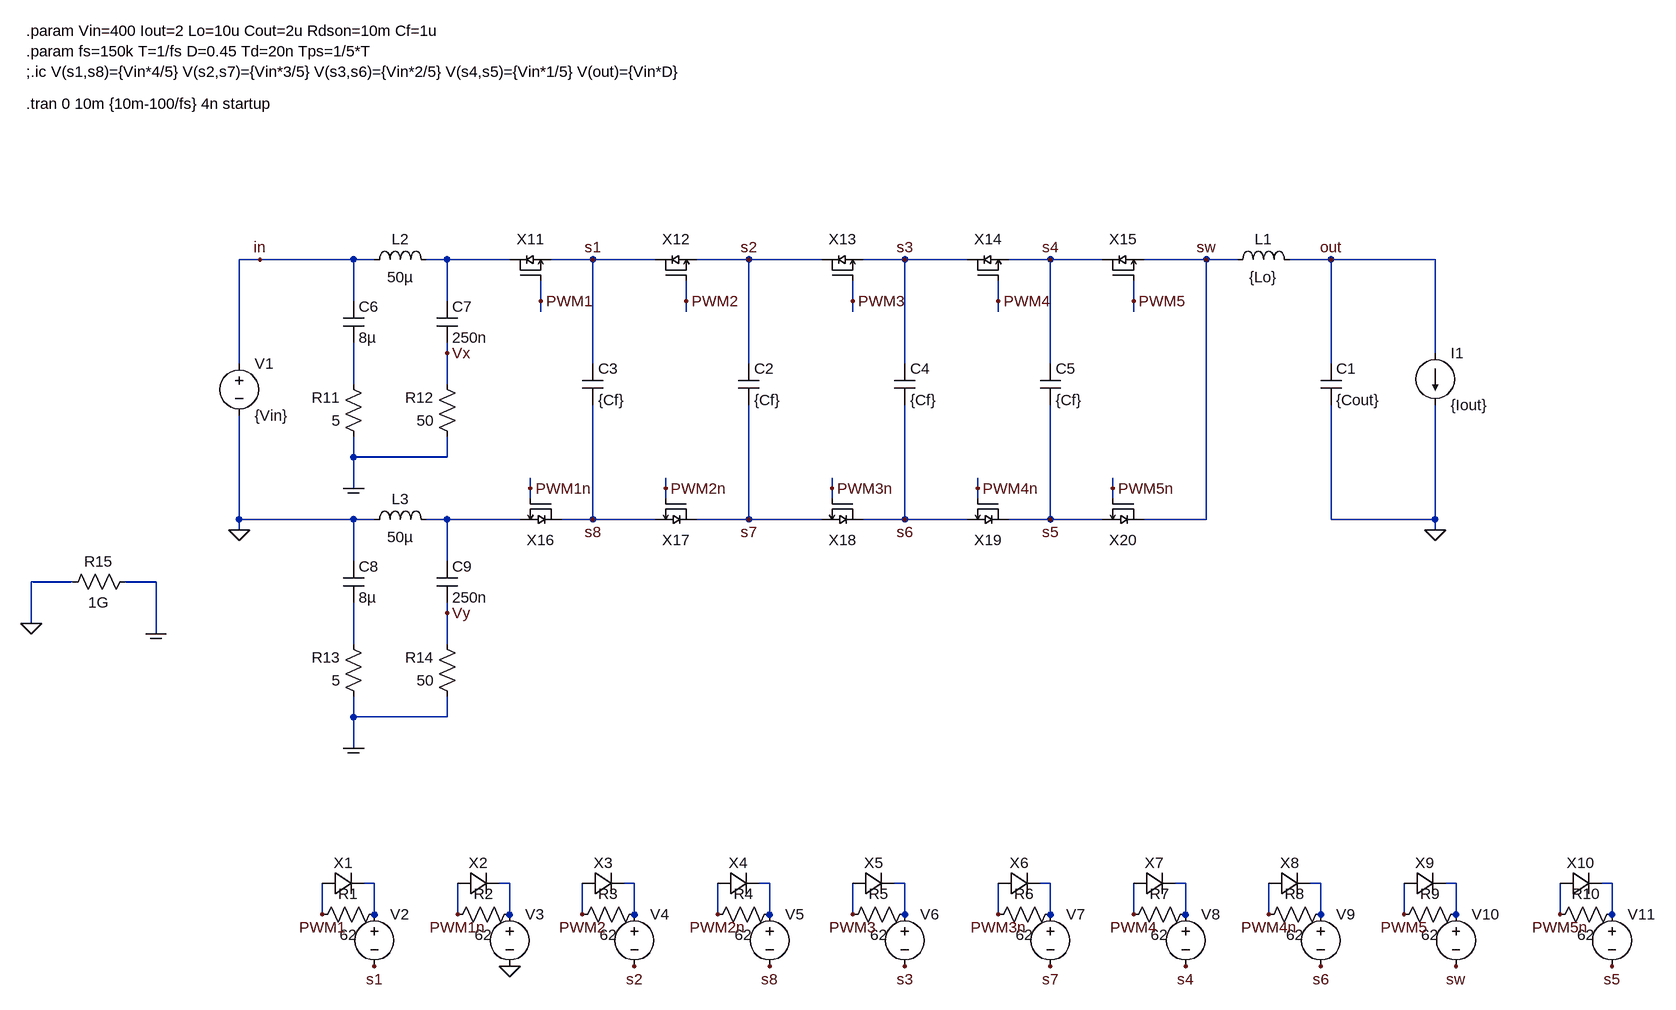
[diagram p0: schematic FCML_5Level_GaNSys_D045_2A.asc]
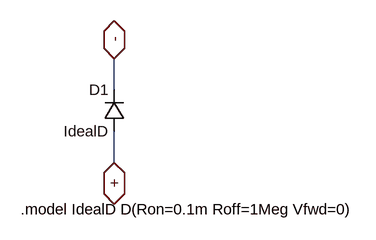
[diagram p1: sub-circuit idealdiode.asc]
FCML_5Level_GaNSys_D045_2A.asc, the LTspice schematic file:
Version 4
SHEET 1 1656 988
WIRE -496 -176 -528 -176
WIRE -352 -176 -496 -176
WIRE -320 -176 -352 -176
WIRE -208 -176 -240 -176
WIRE -112 -176 -208 -176
WIRE 16 -176 -48 -176
WIRE 112 -176 16 -176
WIRE 256 -176 176 -176
WIRE 368 -176 256 -176
WIRE 496 -176 432 -176
WIRE 592 -176 496 -176
WIRE 720 -176 656 -176
WIRE 800 -176 720 -176
WIRE 960 -176 864 -176
WIRE 1008 -176 960 -176
WIRE 1152 -176 1088 -176
WIRE 1312 -176 1152 -176
WIRE -352 -112 -352 -176
WIRE -208 -112 -208 -176
WIRE -64 -112 -64 -144
WIRE 160 -112 160 -144
WIRE 416 -112 416 -144
WIRE 640 -112 640 -144
WIRE 848 -112 848 -144
WIRE -64 -96 -64 -112
WIRE 160 -96 160 -112
WIRE 416 -96 416 -112
WIRE 640 -96 640 -112
WIRE 848 -96 848 -112
WIRE -208 -32 -208 -48
WIRE 1312 -32 1312 -176
WIRE -528 -16 -528 -176
WIRE 16 -16 16 -176
WIRE 256 -16 256 -176
WIRE 496 -16 496 -176
WIRE 720 -16 720 -176
WIRE 1152 -16 1152 -176
WIRE -352 16 -352 -48
WIRE -208 16 -208 -32
WIRE -352 128 -352 96
WIRE -208 128 -208 96
WIRE -208 128 -352 128
WIRE -352 176 -352 128
WIRE -80 176 -80 160
WIRE 128 176 128 160
WIRE 384 176 384 160
WIRE 608 176 608 160
WIRE 816 176 816 160
WIRE -80 192 -80 176
WIRE 128 192 128 176
WIRE 384 192 384 176
WIRE 608 192 608 176
WIRE 816 192 816 176
WIRE -528 224 -528 64
WIRE -352 224 -528 224
WIRE -320 224 -352 224
WIRE -208 224 -240 224
WIRE -96 224 -208 224
WIRE 16 224 16 48
WIRE 16 224 -32 224
WIRE 112 224 16 224
WIRE 256 224 256 48
WIRE 256 224 176 224
WIRE 368 224 256 224
WIRE 496 224 496 48
WIRE 496 224 432 224
WIRE 592 224 496 224
WIRE 720 224 720 48
WIRE 720 224 656 224
WIRE 800 224 720 224
WIRE 960 224 960 -176
WIRE 960 224 864 224
WIRE 1152 224 1152 48
WIRE 1312 224 1312 48
WIRE 1312 224 1152 224
WIRE -528 240 -528 224
WIRE 1312 240 1312 224
WIRE -352 288 -352 224
WIRE -208 288 -208 224
WIRE -784 320 -848 320
WIRE -656 320 -704 320
WIRE -208 368 -208 352
WIRE -848 384 -848 320
WIRE -656 400 -656 320
WIRE -352 416 -352 352
WIRE -208 416 -208 368
WIRE -352 528 -352 496
WIRE -208 528 -208 496
WIRE -208 528 -352 528
WIRE -352 576 -352 528
WIRE -320 784 -336 784
WIRE -112 784 -128 784
WIRE 80 784 64 784
WIRE 288 784 272 784
WIRE 496 784 480 784
WIRE 720 784 704 784
WIRE 928 784 912 784
WIRE 1136 784 1120 784
WIRE 1344 784 1328 784
WIRE 1584 784 1568 784
WIRE -400 832 -400 784
WIRE -320 832 -320 784
WIRE -192 832 -192 784
WIRE -112 832 -112 784
WIRE 0 832 0 784
WIRE 80 832 80 784
WIRE 208 832 208 784
WIRE 288 832 288 784
WIRE 416 832 416 784
WIRE 496 832 496 784
WIRE 640 832 640 784
WIRE 720 832 720 784
WIRE 848 832 848 784
WIRE 928 832 928 784
WIRE 1056 832 1056 784
WIRE 1136 832 1136 784
WIRE 1264 832 1264 784
WIRE 1344 832 1344 784
WIRE 1504 832 1504 784
WIRE 1584 832 1584 784
FLAG -528 240 0
FLAG 1312 240 0
FLAG -400 832 PWM1
FLAG -192 832 PWM1n
FLAG 0 832 PWM2
FLAG 208 832 PWM2n
FLAG -496 -176 in
FLAG 960 -176 sw
FLAG 1152 -176 out
FLAG 128 176 PWM2n
FLAG 416 -112 PWM3
FLAG 384 176 PWM3n
FLAG -64 -112 PWM1
FLAG -80 176 PWM1n
FLAG 416 832 PWM3
FLAG 640 832 PWM3n
FLAG 640 -112 PWM4
FLAG 608 176 PWM4n
FLAG 848 832 PWM4
FLAG 1056 832 PWM4n
FLAG 160 -112 PWM2
FLAG 848 -112 PWM5
FLAG 816 176 PWM5n
FLAG 1264 832 PWM5
FLAG 1504 832 PWM5n
FLAG 16 -176 s1
FLAG 256 -176 s2
FLAG 496 -176 s3
FLAG 720 -176 s4
FLAG 720 224 s5
FLAG 496 224 s6
FLAG 256 224 s7
FLAG 16 224 s8
FLAG -320 912 s1
FLAG -112 912 0
FLAG 80 912 s2
FLAG 288 912 s8
FLAG 496 912 s3
FLAG 720 912 s7
FLAG 1136 912 s6
FLAG 1584 912 s5
FLAG 928 912 s4
FLAG 1344 912 sw
FLAG -352 176 COM
FLAG -208 -32 Vx
FLAG -352 576 COM
FLAG -208 368 Vy
FLAG -848 384 0
FLAG -656 400 COM
SYMBOL voltage -528 -32 R0
WINDOW 123 0 0 Left 0
WINDOW 39 0 0 Left 0
SYMATTR InstName V1
SYMATTR Value {Vin}
SYMBOL ind 992 -160 R270
WINDOW 0 32 56 VTop 2
WINDOW 3 5 56 VBottom 2
SYMATTR InstName L1
SYMATTR Value {Lo}
SYMATTR SpiceLine Rser=9.33m
SYMBOL cap 1136 -16 R0
SYMATTR InstName C1
SYMATTR Value {Cout}
SYMATTR SpiceLine Rser=1m
SYMBOL cap 240 -16 R0
SYMATTR InstName C2
SYMATTR Value {Cf}
SYMATTR SpiceLine Rser=4.3m Lser=.65n
SYMBOL voltage -320 816 R0
WINDOW 3 24 96 Invisible 2
WINDOW 123 0 0 Left 0
WINDOW 39 0 0 Left 0
SYMATTR Value PULSE(0 5 0 1n 1n {D*T} {T})
SYMATTR InstName V2
SYMBOL voltage -112 816 R0
WINDOW 3 24 96 Invisible 2
SYMATTR Value PULSE(0 5 {D*T+Td} 1n 1n {T-D*T-2*Td} {T})
SYMATTR InstName V3
SYMBOL voltage 80 816 R0
WINDOW 3 24 96 Invisible 2
WINDOW 123 0 0 Left 0
WINDOW 39 0 0 Left 0
SYMATTR Value PULSE(0 5 {Tps} 1n 1n {D*T} {T})
SYMATTR InstName V4
SYMBOL voltage 288 816 R0
WINDOW 3 24 96 Invisible 2
WINDOW 123 0 0 Left 0
WINDOW 39 0 0 Left 0
SYMATTR Value PULSE(0 5 {Tps+D*T+Td} 1n 1n {T-D*T-2*Td} {T})
SYMATTR InstName V5
SYMBOL cap 0 -16 R0
SYMATTR InstName C3
SYMATTR Value {Cf}
SYMATTR SpiceLine Rser=4.3m Lser=.65n
SYMBOL voltage 496 816 R0
WINDOW 3 24 96 Invisible 2
WINDOW 123 0 0 Left 0
WINDOW 39 0 0 Left 0
SYMATTR Value PULSE(0 5 {Tps*2} 1n 1n {D*T} {T})
SYMATTR InstName V6
SYMBOL voltage 720 816 R0
WINDOW 3 24 96 Invisible 2
WINDOW 123 0 0 Left 0
WINDOW 39 0 0 Left 0
SYMATTR Value PULSE(0 5 {Tps*2+D*T+Td} 1n 1n {T-D*T-2*Td} {T})
SYMATTR InstName V7
SYMBOL cap 480 -16 R0
SYMATTR InstName C4
SYMATTR Value {Cf}
SYMATTR SpiceLine Rser=4.3m Lser=.65n
SYMBOL voltage 928 816 R0
WINDOW 3 24 96 Invisible 2
WINDOW 123 0 0 Left 0
WINDOW 39 0 0 Left 0
SYMATTR Value PULSE(0 5 {Tps*3} 1n 1n {D*T} {T})
SYMATTR InstName V8
SYMBOL voltage 1136 816 R0
WINDOW 3 24 96 Invisible 2
WINDOW 123 0 0 Left 0
WINDOW 39 0 0 Left 0
SYMATTR Value PULSE(0 5 {Tps*3+D*T+Td} 1n 1n {T-D*T-2*Td} {T})
SYMATTR InstName V9
SYMBOL cap 704 -16 R0
SYMATTR InstName C5
SYMATTR Value {Cf}
SYMATTR SpiceLine Rser=4.3m Lser=.65n
SYMBOL voltage 1344 816 R0
WINDOW 3 24 96 Invisible 2
WINDOW 123 0 0 Left 0
WINDOW 39 0 0 Left 0
SYMATTR Value PULSE(0 5 {Tps*4} 1n 1n {D*T} {T})
SYMATTR InstName V10
SYMBOL voltage 1584 816 R0
WINDOW 3 24 96 Invisible 2
WINDOW 123 0 0 Left 0
WINDOW 39 0 0 Left 0
SYMATTR Value PULSE(0 5 {Tps*4+D*T+Td} 1n 1n {T-D*T-2*Td} {T})
SYMATTR InstName V11
SYMBOL res -304 816 R90
WINDOW 0 0 56 VBottom 2
WINDOW 3 32 56 VTop 2
SYMATTR InstName R1
SYMATTR Value 62
SYMBOL res -96 816 R90
WINDOW 0 0 56 VBottom 2
WINDOW 3 32 56 VTop 2
SYMATTR InstName R2
SYMATTR Value 62
SYMBOL res 96 816 R90
WINDOW 0 0 56 VBottom 2
WINDOW 3 32 56 VTop 2
SYMATTR InstName R3
SYMATTR Value 62
SYMBOL res 304 816 R90
WINDOW 0 0 56 VBottom 2
WINDOW 3 32 56 VTop 2
SYMATTR InstName R4
SYMATTR Value 62
SYMBOL res 512 816 R90
WINDOW 0 0 56 VBottom 2
WINDOW 3 32 56 VTop 2
SYMATTR InstName R5
SYMATTR Value 62
SYMBOL res 736 816 R90
WINDOW 0 0 56 VBottom 2
WINDOW 3 32 56 VTop 2
SYMATTR InstName R6
SYMATTR Value 62
SYMBOL res 944 816 R90
WINDOW 0 0 56 VBottom 2
WINDOW 3 32 56 VTop 2
SYMATTR InstName R7
SYMATTR Value 62
SYMBOL res 1152 816 R90
WINDOW 0 0 56 VBottom 2
WINDOW 3 32 56 VTop 2
SYMATTR InstName R8
SYMATTR Value 62
SYMBOL res 1360 816 R90
WINDOW 0 0 56 VBottom 2
WINDOW 3 32 56 VTop 2
SYMATTR InstName R9
SYMATTR Value 62
SYMBOL res 1600 816 R90
WINDOW 0 0 56 VBottom 2
WINDOW 3 32 56 VTop 2
SYMATTR InstName R10
SYMATTR Value 62
SYMBOL IdealDiode -400 800 R270
WINDOW 0 32 32 VTop 2
SYMATTR InstName X1
SYMBOL IdealDiode -192 800 R270
WINDOW 0 32 32 VTop 2
SYMATTR InstName X2
SYMBOL IdealDiode 0 800 R270
WINDOW 0 32 32 VTop 2
SYMATTR InstName X3
SYMBOL IdealDiode 208 800 R270
WINDOW 0 32 32 VTop 2
SYMATTR InstName X4
SYMBOL IdealDiode 416 800 R270
WINDOW 0 32 32 VTop 2
SYMATTR InstName X5
SYMBOL IdealDiode 640 800 R270
WINDOW 0 32 32 VTop 2
SYMATTR InstName X6
SYMBOL IdealDiode 848 800 R270
WINDOW 0 32 32 VTop 2
SYMATTR InstName X7
SYMBOL IdealDiode 1056 800 R270
WINDOW 0 32 32 VTop 2
SYMATTR InstName X8
SYMBOL IdealDiode 1264 800 R270
WINDOW 0 32 32 VTop 2
SYMATTR InstName X9
SYMBOL IdealDiode 1504 800 R270
WINDOW 0 32 32 VTop 2
SYMATTR InstName X10
SYMBOL current 1312 -32 R0
WINDOW 123 0 0 Left 0
WINDOW 39 0 0 Left 0
SYMATTR InstName I1
SYMATTR Value {Iout}
SYMBOL IdealSW -80 -160 R0
SYMATTR InstName X11
SYMBOL IdealSW 144 -160 R0
SYMATTR InstName X12
SYMBOL IdealSW 400 -160 R0
SYMATTR InstName X13
SYMBOL IdealSW 624 -160 R0
SYMATTR InstName X14
SYMBOL IdealSW 832 -160 R0
SYMATTR InstName X15
SYMBOL IdealSW -64 208 R180
SYMATTR InstName X16
SYMBOL IdealSW 144 208 R180
SYMATTR InstName X17
SYMBOL IdealSW 400 208 R180
SYMATTR InstName X18
SYMBOL IdealSW 624 208 R180
SYMATTR InstName X19
SYMBOL IdealSW 832 208 R180
SYMATTR InstName X20
SYMBOL res -336 112 R180
WINDOW 0 36 76 Left 2
WINDOW 3 36 40 Left 2
SYMATTR InstName R11
SYMATTR Value 5
SYMBOL res -192 112 R180
WINDOW 0 36 76 Left 2
WINDOW 3 36 40 Left 2
SYMATTR InstName R12
SYMATTR Value 50
SYMBOL ind -336 -160 R270
WINDOW 0 32 56 VTop 2
WINDOW 3 5 56 VBottom 2
SYMATTR InstName L2
SYMATTR Value 50µ
SYMBOL cap -368 -112 R0
SYMATTR InstName C6
SYMATTR Value 8µ
SYMBOL cap -224 -112 R0
SYMATTR InstName C7
SYMATTR Value 250n
SYMBOL res -336 512 R180
WINDOW 0 36 76 Left 2
WINDOW 3 36 40 Left 2
SYMATTR InstName R13
SYMATTR Value 5
SYMBOL res -192 512 R180
WINDOW 0 36 76 Left 2
WINDOW 3 36 40 Left 2
SYMATTR InstName R14
SYMATTR Value 50
SYMBOL ind -336 240 R270
WINDOW 0 32 56 VTop 2
WINDOW 3 5 56 VBottom 2
SYMATTR InstName L3
SYMATTR Value 50µ
SYMBOL cap -368 288 R0
SYMATTR InstName C8
SYMATTR Value 8µ
SYMBOL cap -224 288 R0
SYMATTR InstName C9
SYMATTR Value 250n
SYMBOL res -800 336 R270
WINDOW 0 32 56 VTop 2
WINDOW 3 0 56 VBottom 2
SYMATTR InstName R15
SYMATTR Value 1G
TEXT -856 -528 Left 2 !.param Vin=400 Iout=2 Lo=10u Cout=2u Rdson=10m Cf=1u\n.param fs=150k T=1/fs D=0.45 Td=20n Tps=1/5*T\n;.ic V(s1,s8)={Vin*4/5} V(s2,s7)={Vin*3/5} V(s3,s6)={Vin*2/5} V(s4,s5)={Vin*1/5} V(out)={Vin*D}
TEXT -856 -416 Left 2 !.tran 0 10m {10m-100/fs} 4n startup

idealdiode.asc, the sub-circuit schematic file:
Version 4
SHEET 1 880 680
WIRE 336 144 336 96
WIRE 336 256 336 208
FLAG 336 96 -
IOPIN 336 96 BiDir
FLAG 336 256 +
IOPIN 336 256 BiDir
SYMBOL diode 352 208 R180
WINDOW 0 24 64 Left 2
WINDOW 3 24 0 Left 2
SYMATTR InstName D1
SYMATTR Value IdealD
TEXT 192 328 Left 2 !.model IdealD D(Ron=0.1m Roff=1Meg Vfwd=0)

The netlist it stands for:
* FCML_5Level_GaNSys_D045_2A.asc
V1 in 0 {Vin}
L1 sw out {Lo} Rser=9.33m
C1 out 0 {Cout} Rser=1m
C2 s2 s7 {Cf} Rser=4.3m Lser=.65n
V2 N005 s1 PULSE(0 5 0 1n 1n {D*T} {T})
V3 N006 0 PULSE(0 5 {D*T+Td} 1n 1n {T-D*T-2*Td} {T})
V4 N007 s2 PULSE(0 5 {Tps} 1n 1n {D*T} {T})
V5 N008 s8 PULSE(0 5 {Tps+D*T+Td} 1n 1n {T-D*T-2*Td} {T})
C3 s1 s8 {Cf} Rser=4.3m Lser=.65n
V6 N009 s3 PULSE(0 5 {Tps*2} 1n 1n {D*T} {T})
V7 N010 s7 PULSE(0 5 {Tps*2+D*T+Td} 1n 1n {T-D*T-2*Td} {T})
C4 s3 s6 {Cf} Rser=4.3m Lser=.65n
V8 N011 s4 PULSE(0 5 {Tps*3} 1n 1n {D*T} {T})
V9 N012 s6 PULSE(0 5 {Tps*3+D*T+Td} 1n 1n {T-D*T-2*Td} {T})
C5 s4 s5 {Cf} Rser=4.3m Lser=.65n
V10 N013 sw PULSE(0 5 {Tps*4} 1n 1n {D*T} {T})
V11 N014 s5 PULSE(0 5 {Tps*4+D*T+Td} 1n 1n {T-D*T-2*Td} {T})
R1 N005 PWM1 62
R2 N006 PWM1n 62
R3 N007 PWM2 62
R4 N008 PWM2n 62
R5 N009 PWM3 62
R6 N010 PWM3n 62
R7 N011 PWM4 62
R8 N012 PWM4n 62
R9 N013 PWM5 62
R10 N014 PWM5n 62
XX1 PWM1 N005 idealdiode
XX2 PWM1n N006 idealdiode
XX3 PWM2 N007 idealdiode
XX4 PWM2n N008 idealdiode
XX5 PWM3 N009 idealdiode
XX6 PWM3n N010 idealdiode
XX7 PWM4 N011 idealdiode
XX8 PWM4n N012 idealdiode
XX9 PWM5 N013 idealdiode
XX10 PWM5n N014 idealdiode
I1 out 0 {Iout}
XX11 N001 PWM1 s1 IdealSW  ; pins D G S
XX12 s1 PWM2 s2 IdealSW  ; pins D G S
XX13 s2 PWM3 s3 IdealSW  ; pins D G S
XX14 s3 PWM4 s4 IdealSW  ; pins D G S
XX15 s4 PWM5 sw IdealSW  ; pins D G S
XX16 s8 PWM1n N003 IdealSW  ; pins D G S
XX17 s7 PWM2n s8 IdealSW  ; pins D G S
XX18 s6 PWM3n s7 IdealSW  ; pins D G S
XX19 s5 PWM4n s6 IdealSW  ; pins D G S
XX20 sw PWM5n s5 IdealSW  ; pins D G S
R11 COM N002 5
R12 COM Vx 50
L2 in N001 50µ
C6 in N002 8µ
C7 N001 Vx 250n
R13 COM N004 5
R14 COM Vy 50
L3 0 N003 50µ
C8 0 N004 8µ
C9 N003 Vy 250n
R15 0 COM 1G

* block symbol definitions
.subckt idealdiode + -
D1 + - IdealD
.model IdealD D(Ron=0.1m Roff=1Meg Vfwd=0)
.ends idealdiode

.model D D
.lib standard.dio
.param Vin=400 Iout=2 Lo=10u Cout=2u Rdson=10m Cf=1u
.param fs=150k T=1/fs D=0.45 Td=20n Tps=1/5*T
;.ic V(s1,s8)={Vin*4/5} V(s2,s7)={Vin*3/5} V(s3,s6)={Vin*2/5} V(s4,s5)={Vin*1/5} V(out)={Vin*D}
.tran 0 10m {10m-100/fs} 4n startup
.backanno
.end